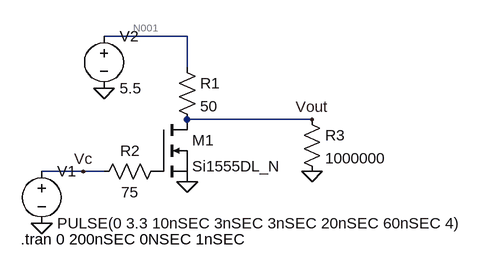
[diagram p0: schematic NchFETtest.asc]
NchFETtest.asc, the LTspice schematic file:
Version 4
SHEET 1 880 680
WIRE 176 -16 48 -16
WIRE 176 32 176 -16
WIRE 368 112 176 112
WIRE 16 192 -48 192
WIRE 48 192 16 192
FLAG 176 208 0
FLAG 368 192 0
FLAG 368 112 Vout
FLAG -48 272 0
FLAG 48 64 0
FLAG 16 192 Vc
SYMBOL nmos 128 112 R0
SYMATTR InstName M1
SYMATTR Value Si1555DL_N
SYMBOL res 160 16 R0
SYMATTR InstName R1
SYMATTR Value 50
SYMBOL res 144 176 R90
WINDOW 0 0 56 VBottom 2
WINDOW 3 32 56 VTop 2
SYMATTR InstName R2
SYMATTR Value 75
SYMBOL res 352 96 R0
SYMATTR InstName R3
SYMATTR Value 1000000
SYMBOL voltage -48 176 R0
WINDOW 123 0 0 Left 2
WINDOW 39 0 0 Left 2
SYMATTR InstName V1
SYMATTR Value PULSE(0 3.3 10nSEC 3nSEC 3nSEC 20nSEC 60nSEC 4)
SYMBOL voltage 48 -32 R0
SYMATTR InstName V2
SYMATTR Value 5.5
TEXT -80 296 Left 2 !.tran 0 200nSEC 0NSEC 1nSEC

The netlist it stands for:
* NchFETtest.asc
M1 Vout P001 0 0 Si1555DL_N
R1 N001 Vout 50
R2 P001 Vc 75
R3 Vout 0 1000000
V1 Vc 0 PULSE(0 3.3 10nSEC 3nSEC 3nSEC 20nSEC 60nSEC 4)
V2 N001 0 5.5
.model NMOS NMOS
.model PMOS PMOS
.lib standard.mos
.tran 0 200nSEC 0NSEC 1nSEC
.backanno
.end

* Results of the author's LTspice run, read from the files saved beside the schematic
* Operating Point, zero values left out:
*   V(vout) = 5.5 V
*   V(n001) = 5.5 V
*   Id(M1) = 7.5 pA
*   Is(M1) = -7.5 pA
*   I(R3) = 5.5 µA
*   I(R1) = 5.5 µA
*   I(V2) = -5.5 µA
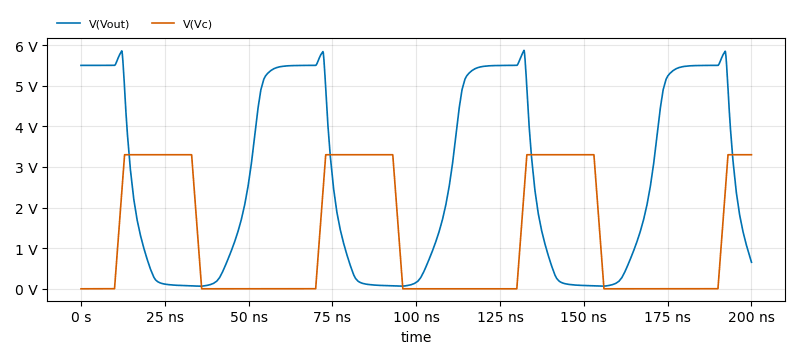
[diagram p1: Transient Analysis of NchFETtest.asc, plotted from the saved traces]
* Transient Analysis, 1 run:
*   V(Vout): min 65.07 mV, max 5.869 V, average 2.65 V, rms 3.541 V, last 653.2 mV
*   V(Vc): min 0 V, max 3.3 V, average 1.279 V, rms 2.009 V, last 3.3 V